# Altium schematic sheet 05021002_Serial.SchDoc: Ipê Board
size A4; Organization: Cerebra SC; Address1: R. Coriolano José Gilbertone; Address2: Jd. Paulista; Address3: n° 703; Address4: São Carlos - Brasil; DocumentNumber: 4; Revision: A; SheetNumber: 4; SheetTotal: 8
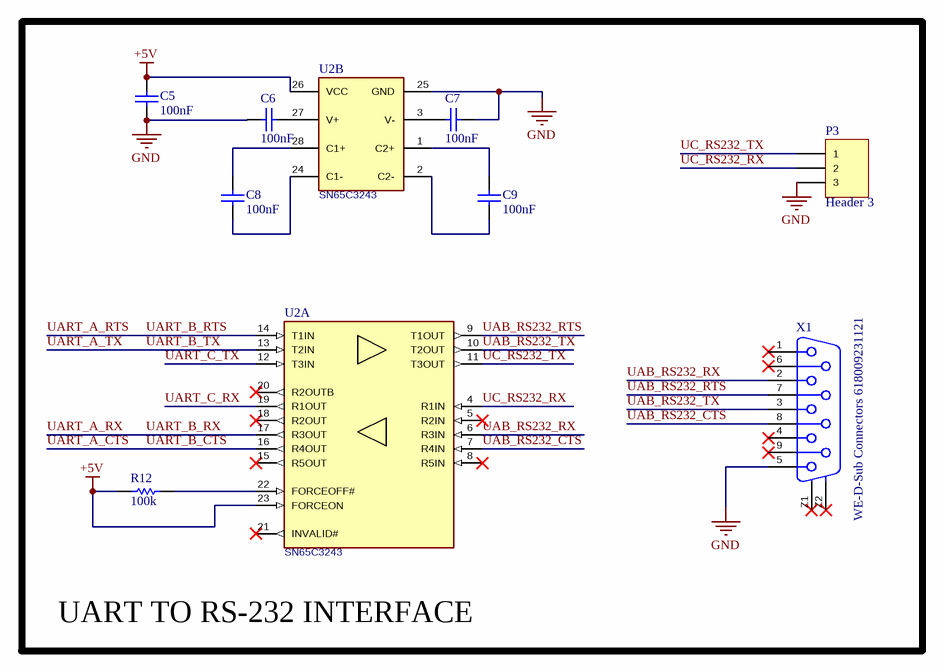
[diagram p0: 05021002_Serial.SchDoc]

## Parts
C5  100nF  [CAPC2012X135N]
C6  100nF  [CAPC2012X135N]
C7  100nF  [CAPC2012X135N]
C8  100nF  [CAPC2012X135N]
C9  100nF  [CAPC2012X135N]
P3  Header 3  [HDR1X3]
R12  100k  [0805]
U2  SN65C3243  [SOP65P780X200-28N]  (parts A,B of 2)
X1  WE-D-Sub Connectors 618009231121  [618009231121]

## Blocks framed on the sheet
UART TO RS-232 INTERFACE: C5-C9 P3 R12 U2 X1

## Nets
+5V: C5.2 R12.1 U2.23(FORCEON) U2.26(VCC)
GND: C5.1 C6.1 C7.2 P3.3 U2.25(GND) X1.5
UAB_RS232_CTS: U2.7(R4IN) X1.8
UAB_RS232_RTS: U2.9(T1OUT) X1.7
UAB_RS232_RX: U2.6(R3IN) X1.2
UAB_RS232_TX: U2.10(T2OUT) X1.3
UART_A_CTS: U2.16(R4OUT)  [also labelled UART_B_CTS]
UART_A_RTS: U2.14(T1IN)  [also labelled UART_B_RTS]
UART_A_RX: U2.17(R3OUT)  [also labelled UART_B_RX]
UART_A_TX: U2.13(T2IN)  [also labelled UART_B_TX]
UART_C_RX: U2.19(R1OUT)
UART_C_TX: U2.12(T3IN)
UC_RS232_RX: P3.2 U2.4(R1IN)
UC_RS232_TX: P3.1 U2.11(T3OUT)
NetC6_2: C6.2 U2.27(V+)
NetC7_1: C7.1 U2.3(V-)
NetC8_1: C8.1 U2.24(C1-)
NetC8_2: C8.2 U2.28(C1+)
NetC9_1: C9.1 U2.2(C2-)
NetC9_2: C9.2 U2.1(C2+)
NetR12_2: R12.2 U2.22(FORCEOFF#)

Not connected (* = marked no-connect by the designer): U2 5(R2IN)* 8(R5IN)* 15(R5OUT)* 18(R2OUT)* 20(R2OUTB)* 21(INVALID#)*; X1 1* 4* 6* 9* Z1(GND)* Z2(GND)*

## Notes on the sheet
- Title
- Size:
- Date:
- A4
- Number:
- Time:
- Revision:
- Sheet
- of
- File:

## Library data of the parts
C5-C9 = capacitor_gen: Generic Capacitor; Part Number 1: 885012207016; Manufacturer 1: Wurth Electronics Inc; Value: 100nF
P3 = Header 3: Header, 3-Pin; LatestRevisionDate: 17-Jul-2002; LatestRevisionNote: Re-released for DXP Platform.; Publisher: Altium Limited
R12 = resistor_gen: Part Number 1: RC0805JR-07100KL; Manufacturer 1: Yageo; Value: 100k
U2 = IC-TI-SN65C3243: RS-232 Serial Transceiver; Manufacturer 1: Texas Instruments; Part Number 1: SN65C3243
X1 = WE-D-Sub Connectors 618009231121: WR-DSUB Female Angled PCB Connector; Manufacturer 1: Wurth Elektronik; ComponentLink1 Description: Manufacturer; ComponentLink2 Description: Datasheet; NoPins: 9; ComponentLink1URL: http://www.we-online.de; ComponentLink2URL: http://katalog.we-online.de/em/datasheet/6180xx231121.pdf; Created by: Karrer Zheng; Created Date: 10/16/2014; Part Number 1: 618009231121